# EAGLE board FAST_DEPLOY_E_FUSE (EAGLE 9.6.2)
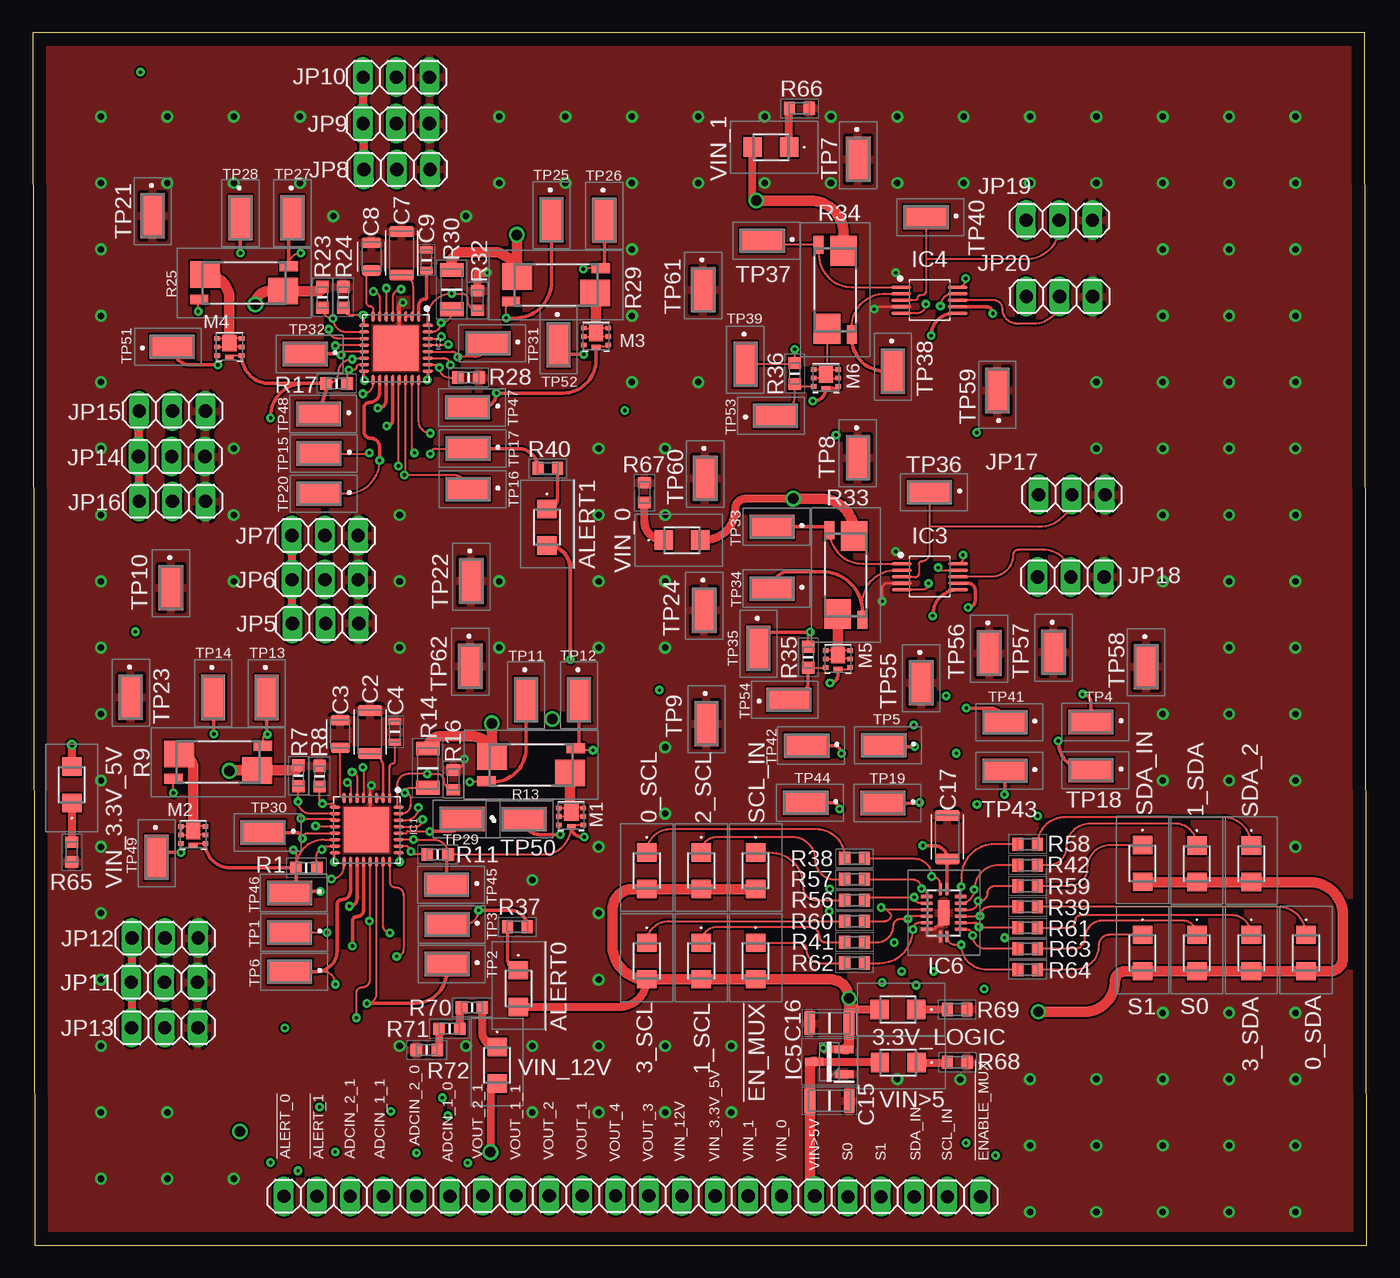
[diagram p6: board, top side]
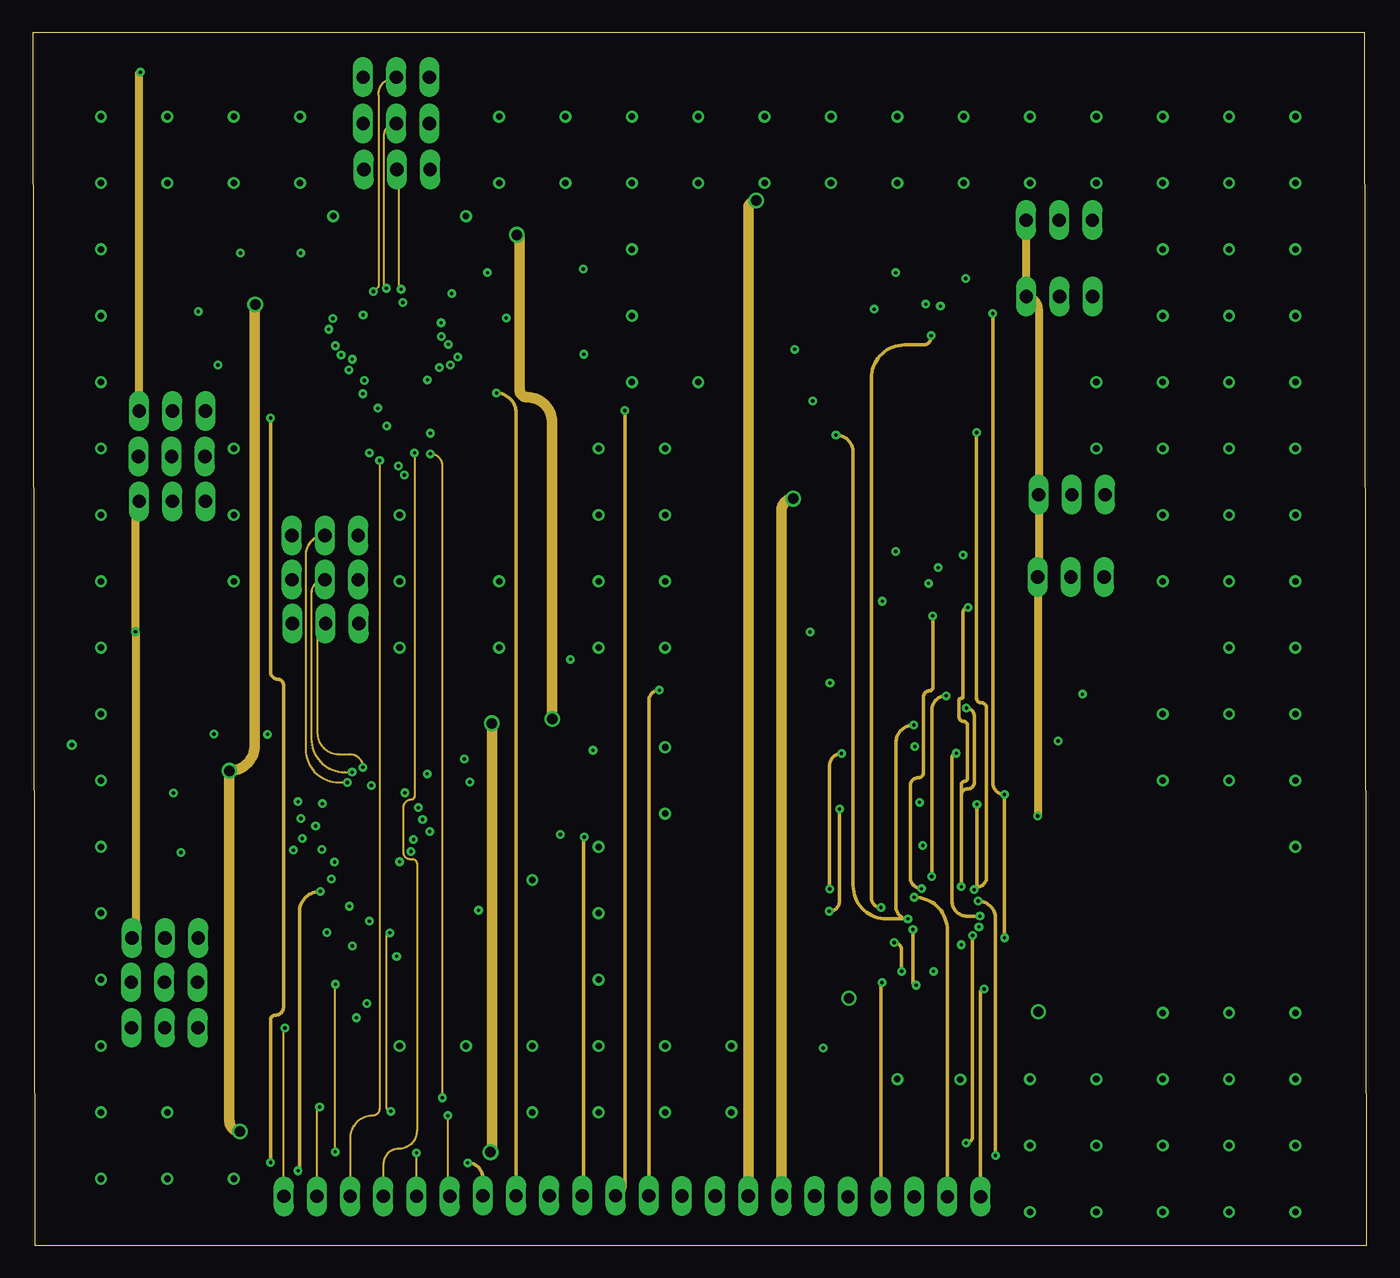
[diagram p7: board, inner layer Route2]
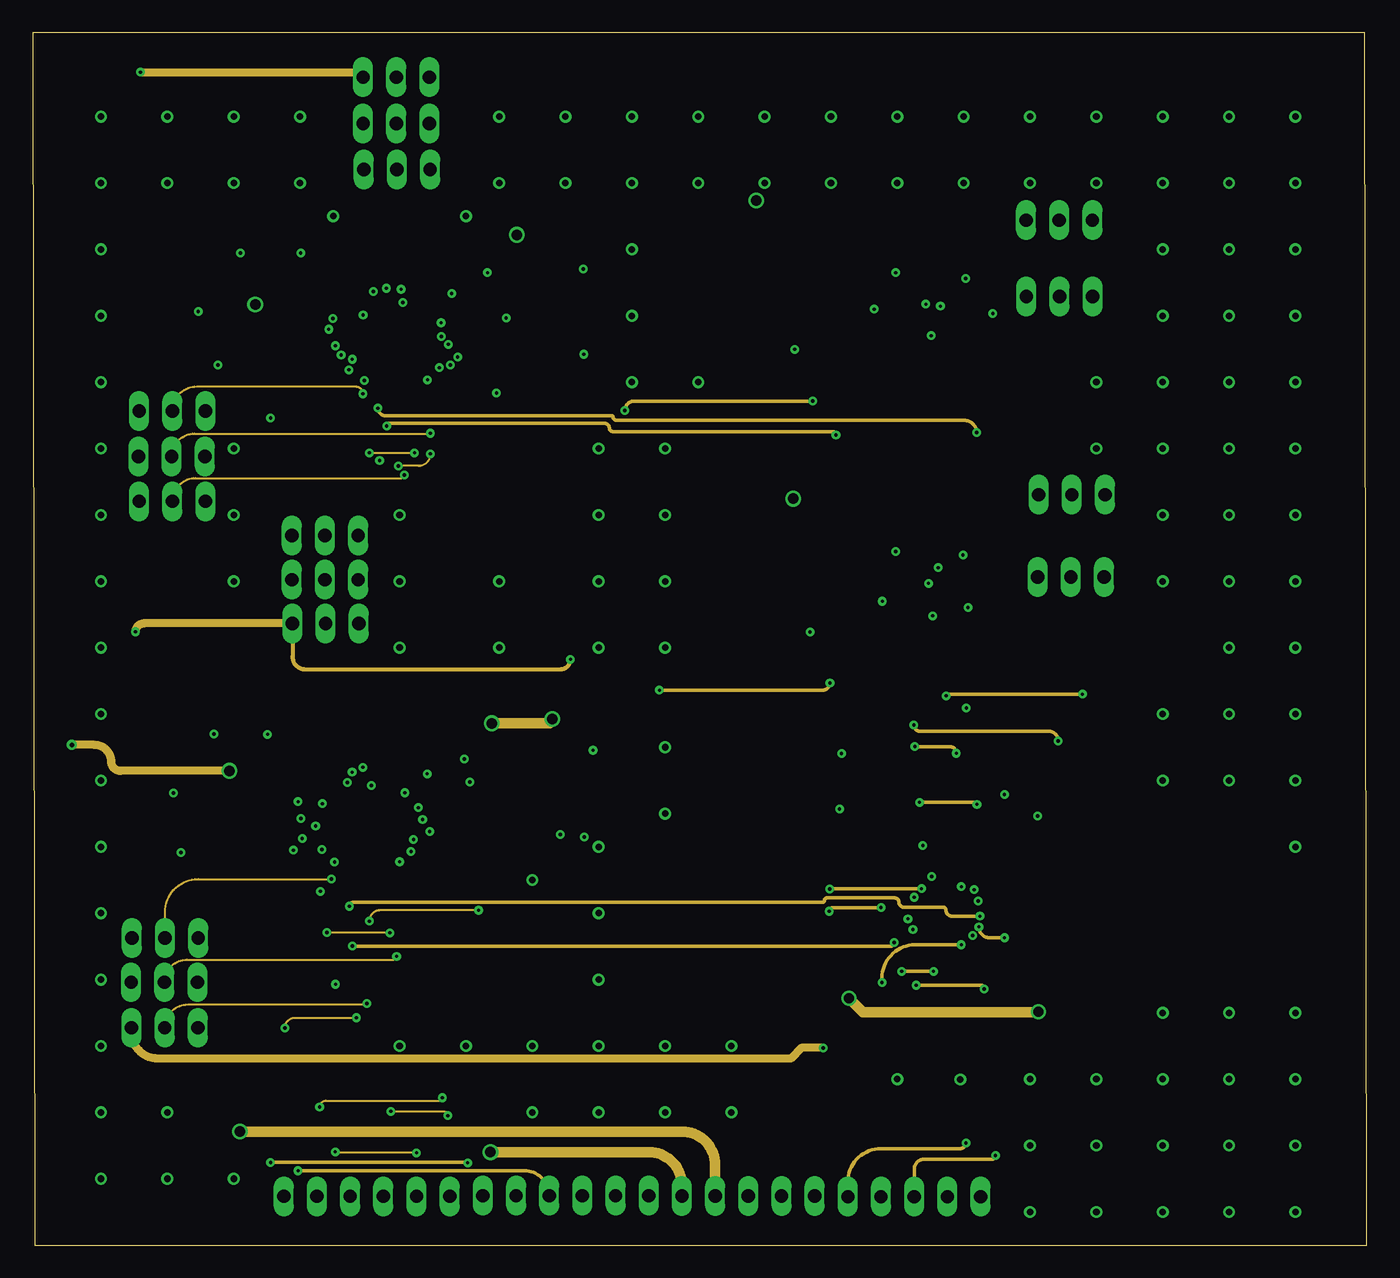
[diagram p8: board, inner layer Route15]
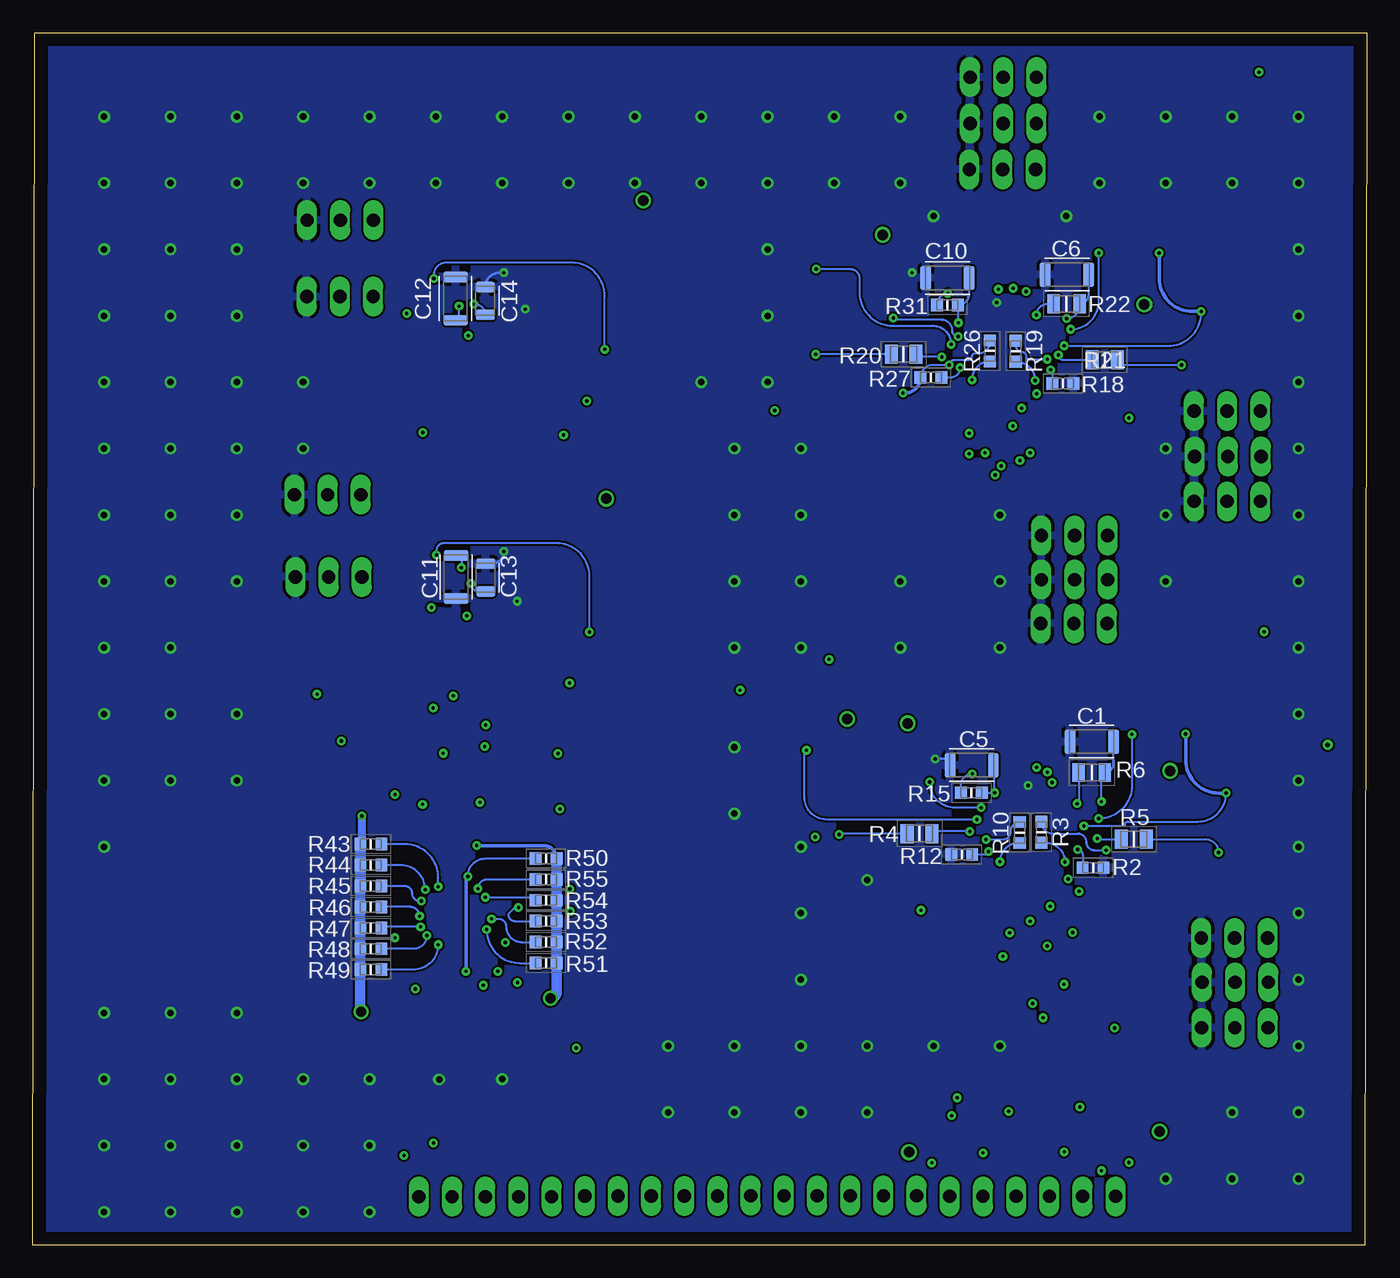
[diagram p9: board, bottom side, seen from below]

Size 102.14 x 92.79 mm. Coordinates in mm from the lower left corner, seen from the top.
Outline: 0.15,0 102.14,0 101.99,92.79 0,92.79 0.15,0
Copper layers (1+2*15+16): Top 0.035mm / dielectric 1.5mm / Route2 0.035mm / dielectric 0.15mm / Route15 0.035mm / dielectric 0.2mm / Bottom 0.035mm
Design rules "default *": minimum track width 6mil, minimum drill 0.2mm, track to track 6mil, track to pad 6mil, pad to pad 6mil, via to via 6mil, smd to smd 6mil, copper to edge 40mil, drill to drill 6mil, minimum pad ring 10mil, minimum via ring 8mil, stop-mask expansion 0mil, vias tented up to drill 40mil, thermal gap 10mil

## Footprints (pad centres in the part's own frame; a part is rotated, then mirrored left to right if it is on the bottom)
AA3021LSYSKJ3TR = smd 1.4 x 1.5: 1 -1.4,0; 2 1.4,0
CAPC3216X180N = smd 0.826 x 1.85: 1 -1.662,0; 2 1.662,0
CAPC2012X145N = smd 0.792 x 1.465: 1 -1.062,0; 2 1.062,0
CAPC1608X90N = smd 0.54 x 0.94: 1 -0.8,0; 2 0.8,0
CAPC3216X190N = smd 0.82 x 1.82: 1 -1.5,0; 2 1.5,0
QFN50P500X500X80-33T345N = smd 0.848 x 0.247: 1 -2.433,1.75; 2 -2.433,1.25; 3 -2.433,0.75; 4 -2.433,0.25; 5 -2.433,-0.25; 6 -2.433,-0.75; 7 -2.433,-1.25; 8 -2.433,-1.75; 17 2.433,-1.75; 18 2.433,-1.25; 19 2.433,-0.75; 20 2.433,-0.25; 21 2.433,0.25; 22 2.433,0.75; 23 2.433,1.25; 24 2.433,1.75 | smd 0.247 x 0.848: 9 -1.75,-2.433; 10 -1.25,-2.433; 11 -0.75,-2.433; 12 -0.25,-2.433; 13 0.25,-2.433; 14 0.75,-2.433; 15 1.25,-2.433; 16 1.75,-2.433; 25 1.75,2.433; 26 1.25,2.433; 27 0.75,2.433; 28 0.25,2.433; 29 -0.25,2.433; 30 -0.75,2.433; 31 -1.25,2.433; 32 -1.75,2.433 | smd 3.45 x 3.45: 33 0,0
SOP50P490X110-10N = smd 1.544 x 0.279: 1 -2.156,1; 2 -2.156,0.5; 3 -2.156,0; 4 -2.156,-0.5; 5 -2.156,-1; 6 2.156,-1; 7 2.156,-0.5; 8 2.156,0; 9 2.156,0.5; 10 2.156,1
SOT95P255X145-3N = smd 1.4 x 0.6: 1 -1.15,0.95; 2 -1.15,-0.95; 3 1.15,0
74HCT595BQ115 = smd 0.9 x 0.24: 1 -1.8,-0.25; 8 1.8,-0.25; 9 1.8,0.25; 16 -1.8,0.25 | smd 0.24 x 0.9: 2 -1.25,-1.3; 3 -0.75,-1.3; 4 -0.25,-1.3; 5 0.25,-1.3; 6 0.75,-1.3; 7 1.25,-1.3; 10 1.25,1.3; 11 0.75,1.3; 12 0.25,1.3; 13 -0.25,1.3; 14 -0.75,1.3; 15 -1.25,1.3 | smd 1.9 x 0.9: 17 0,0
1X06 = drill 1.016 long: 1 -6.35,0; 2 -3.81,0; 3 -1.27,0; 4 1.27,0; 5 3.81,0; 6 6.35,0
1X04 = drill 1.016 long: 1 -3.81,0; 2 -1.27,0; 3 1.27,0; 4 3.81,0
1X05 = drill 1.016 long: 1 -5.08,0; 2 -2.54,0; 3 0,0; 4 2.54,0; 5 5.08,0
1X03 = drill 1.016 long: 1 -2.54,0; 2 0,0; 3 2.54,0
1X02 = drill 1.016 long: 1 -1.27,0; 2 1.27,0
TRANS_NTLUS3A18PZTAG = smd 0.43 x 0.35: 1 -0.935,0.65; 2 -0.935,0; 3 -0.935,-0.65; 4 0.935,-0.65; 5 0.935,0; 6 0.935,0.65 | smd 1.1 x 1.25: 7 0,0.285 | smd 0.66 x 0.35: 8 0,-0.775
RESC1608X55N = smd 0.9 x 0.95: 1 -0.8,0; 2 0.8,0
RESC2012X60N = smd 1 x 1.45: 1 -0.95,0; 2 0.95,0
RESC2012X50N = smd 0.95 x 1.45: 1 -1,0; 2 1,0
WSK2512R0100FEA = smd 2.29 x 2.03: 1 -2.985,0.635; 3 2.985,-0.635 | smd 1.4 x 0.76: 2 -3.43,-1.27; 4 3.43,1.27
RESC3216X60N = smd 1.05 x 1.8: 1 -1.5,0; 2 1.5,0
RESC1608X50N = smd 0.85 x 1: 1 -0.75,0; 2 0.75,0
S175146R = smd 3.45 x 1.85: 1 0,0

## Placement (x,y rotation side)
0_SCL  AA3021LSYSK_J3-TR  [AA3021LSYSKJ3TR]  47.02,28.65 270 top
0_SDA  AA3021LSYSK_J3-TR  [AA3021LSYSKJ3TR]  97.49,22.35 270 top
1_SCL  AA3021LSYSK_J3-TR  [AA3021LSYSKJ3TR]  51.18,21.74 270 top
1_SDA  AA3021LSYSK_J3-TR  [AA3021LSYSKJ3TR]  89.13,29.18 270 top
2_SCL  AA3021LSYSK_J3-TR  [AA3021LSYSKJ3TR]  51.18,28.65 270 top
3.3V_LOGIC  AA3021LSYSK_J3-TR  [AA3021LSYSKJ3TR]  66.24,18.03 180 top
3_SCL  AA3021LSYSK_J3-TR  [AA3021LSYSKJ3TR]  47.02,21.74 270 top
3_SDA  AA3021LSYSK_J3-TR  [AA3021LSYSKJ3TR]  93.29,22.35 270 top
!ALERT0  AA3021LSYSK_J3-TR  [AA3021LSYSKJ3TR]  37.19,19.63 270 top
!ALERT1  AA3021LSYSK_J3-TR  [AA3021LSYSKJ3TR]  39.37,54.94 270 top
!EN_MUX  AA3021LSYSK_J3-TR  [AA3021LSYSKJ3TR]  55.35,21.74 270 top
C1  CGA5L2C0G1H104J160AA  [CAPC3216X180N]  21.06,38.53 180 bottom
C2  CGA5L2C0G1H104J160AA  [CAPC3216X180N]  25.83,39.27 90 top
C3  CGA4J3X7R1H105K125AB  [CAPC2012X145N]  23.55,39.12 90 top
C4  CGA3E2X7R1H683K080AA  [CAPC1608X90N]  27.74,39.29 90 top
C5  CGA5L2C0G1H104J160AA  [CAPC3216X180N]  30.25,36.73 180 bottom
C6  CGA5L2C0G1H104J160AA  [CAPC3216X180N]  22.96,74.27 180 bottom
C7  CGA5L2C0G1H104J160AA  [CAPC3216X180N]  28.24,75.92 90 top
C8  CGA4J3X7R1H105K125AB  [CAPC2012X145N]  25.93,75.64 90 top
C9  CGA3E2X7R1H683K080AA  [CAPC1608X90N]  30.15,75.39 90 top
C10  CGA5L2C0G1H104J160AA  [CAPC3216X180N]  32.11,74.02 180 bottom
C11  CGA5L2C0G1H104J160AA  [CAPC3216X180N]  69.72,51.13 270 bottom
C12  CGA5L2C0G1H104J160AA  [CAPC3216X180N]  69.77,72.44 90 bottom
C13  CGA4J3X7R1H105K125AB  [CAPC2012X145N]  67.46,51.08 90 bottom
C14  CGA4J3X7R1H105K125AB  [CAPC2012X145N]  67.49,72.26 90 bottom
C15  CGA5L3X7R1H225K160AB  [CAPC3216X190N]  61.01,11.05 0 top
C16  CGA5L3X7R1H225K160AB  [CAPC3216X190N]  60.99,16.99 180 top
C17  CGA5L2C0G1H104J160AA  [CAPC3216X180N]  70.03,31.22 270 top
IC1  LTC4222CUH#PBF  [QFN50P500X500X80-33T345N]  25.58,31.78 270 top
IC2  LTC4222CUH#PBF  [QFN50P500X500X80-33T345N]  27.81,68.63 270 top
IC3  ADM1177-2ARMZ-R7  [SOP50P490X110-10N]  68.68,51.16 0 top
IC4  ADM1177-2ARMZ-R7  [SOP50P490X110-10N]  68.66,72.31 0 top
IC5  MCP1792T-3302H_CB  [SOT95P255X145-3N]  60.99,14.02 180 top
IC6  74HC4852BQ,115  [74HCT595BQ115]  69.75,25.43 270 top
JP1  [1X06]  40.82,3.78 0 top
JP3  [1X04]  28.12,3.73 0 top
JP4  [1X05]  54.79,3.76 0 top
JP5  [1X03]  22.43,47.57 0 top
JP6  [1X03]  22.38,50.93 0 top
JP7  [1X03]  22.38,54.31 0 top
JP8  [1X03]  27.89,82.32 0 top
JP9  [1X03]  27.84,85.83 0 top
JP10  [1X03]  27.84,89.38 0 top
JP11  [1X03]  10.08,20.12 0 top
JP12  [1X03]  10.13,23.5 0 top
JP13  [1X03]  10.11,16.64 0 top
JP14  [1X03]  10.64,60.35 0 top
JP15  [1X03]  10.69,63.83 0 top
JP16  [1X03]  10.69,56.92 0 top
JP17  [1X03]  79.55,57.43 0 top
JP18  [1X03]  79.48,51.13 0 top
JP19  [1X03]  78.59,78.44 0 top
JP20  [1X03]  78.61,72.59 0 top
JP21  [1X02]  20.5,3.73 0 top
JP22  [1X05]  67.49,3.71 0 top
M1  NTLUS4C12NTAG  [TRANS_NTLUS3A18PZTAG]  41.22,32.82 0 top
M2  NTLUS4C12NTAG  [TRANS_NTLUS3A18PZTAG]  12.29,31.39 0 top
M3  NTLUS4C12NTAG  [TRANS_NTLUS3A18PZTAG]  43.13,69.52 0 top
M4  NTLUS4C12NTAG  [TRANS_NTLUS3A18PZTAG]  15.06,68.73 0 top
M5  NTLUS4C12NTAG  [TRANS_NTLUS3A18PZTAG]  61.65,44.86 0 top
M6  NTLUS4C12NTAG  [TRANS_NTLUS3A18PZTAG]  60.73,66.34 0 top
R1  CRCW06032K00FKEAC  [RESC1608X55N]  20.96,28.88 0 top
R2  CRCW06032K00FKEAC  [RESC1608X55N]  20.96,28.88 0 bottom
R3  CRCW060310K0JNEAC  [RESC1608X55N]  24.92,31.6 90 bottom
R4  CRCW080510R0JNEAHP  [RESC2012X60N]  34.24,31.5 0 bottom
R5  CRCW080510R0JNEAHP  [RESC2012X60N]  17.83,31.06 180 bottom
R6  CRCW08055K90FKTA  [RESC2012X50N]  21.06,36.17 180 bottom
R7  CRCW06032K00FKEAC  [RESC1608X55N]  20.35,35.92 270 top
R8  CRCW06032K00FKEAC  [RESC1608X55N]  21.97,35.89 90 top
R9  WSK2512R0250FEA  [WSK2512R0100FEA]  14.2,36.96 180 top
R10  CRCW060310K0JNEAC  [RESC1608X55N]  26.57,31.57 90 bottom
R11  CRCW060310K0JNEAC  [RESC1608X55N]  31.01,29.9 180 top
R12  CRCW06032K00FKEAC  [RESC1608X55N]  31.01,29.9 0 bottom
R13  WSK2512R0250FEA  [WSK2512R0100FEA]  38.15,36.75 0 top
R14  CRCW12067K00JNTA  [RESC3216X60N]  30.25,36.5 270 top
R15  CRCW06032K00FKEAC  [RESC1608X55N]  30.28,34.62 180 bottom
R16  CRCW0603820RFKEA  [RESC1608X50N]  32.21,35.61 90 top
R17  CRCW06032K00FKEAC  [RESC1608X55N]  23.27,65.94 0 top
R18  CRCW06032K00FKEAC  [RESC1608X55N]  23.27,65.94 0 bottom
R19  CRCW060310K0JNEAC  [RESC1608X55N]  26.87,68.4 90 bottom
R20  CRCW080510R0JNEAHP  [RESC2012X60N]  35.46,68.17 0 bottom
R21  CRCW080510R0JNEAHP  [RESC2012X60N]  20.07,67.74 180 bottom
R22  CRCW08055K90FKTA  [RESC2012X50N]  22.99,72.03 180 bottom
R23  CRCW06032K00FKEAC  [RESC1608X55N]  22.17,72.54 270 top
R24  CRCW06032K00FKEAC  [RESC1608X55N]  23.77,72.54 90 top
R25  WSK2512R0250FEA  [WSK2512R0100FEA]  16.18,73.63 180 top
R26  CRCW060310K0JNEAC  [RESC1608X55N]  28.85,68.43 90 bottom
R27  CRCW060310K0JNEAC  [RESC1608X55N]  33.38,66.4 0 bottom
R28  CRCW06032K00FKEAC  [RESC1608X55N]  33.38,66.4 180 top
R29  WSK2512R0250FEA  [WSK2512R0100FEA]  40.06,73.48 0 top
R30  CRCW12067K00JNTA  [RESC3216X60N]  32.08,73.13 270 top
R31  CRCW06032K00FKEAC  [RESC1608X55N]  32.11,71.93 180 bottom
R32  CRCW0603820RFKEA  [RESC1608X50N]  34.06,72.29 90 top
R33  WSK2512R0250FEA  [WSK2512R0100FEA]  62.26,51.28 270 top
R34  WSK2512R0250FEA  [WSK2512R0100FEA]  61.44,73.13 270 top
R35  CRCW06032K00FKEAC  [RESC1608X55N]  59.36,44.98 90 top
R36  CRCW06032K00FKEAC  [RESC1608X55N]  58.34,66.7 90 top
R37  CRCW0603820RFKEA  [RESC1608X50N]  37.11,24.36 0 top
R38  CRCW0603820RFKEA  [RESC1608X50N]  62.92,29.59 0 top
R39  CRCW0603820RFKEA  [RESC1608X50N]  76.17,25.88 180 top
R40  CRCW0603820RFKEA  [RESC1608X50N]  39.45,59.44 180 top
R41  CRCW0603820RFKEA  [RESC1608X50N]  62.92,23.19 0 top
R42  CRCW0603820RFKEA  [RESC1608X50N]  76.17,29.08 180 top
R43  CRCW06032K00FKEAC  [RESC1608X55N]  76.25,30.68 180 bottom
R44  CRCW06032K00FKEAC  [RESC1608X55N]  76.25,29.08 180 bottom
R45  CRCW06032K00FKEAC  [RESC1608X55N]  76.25,27.48 180 bottom
R46  CRCW06032K00FKEAC  [RESC1608X55N]  76.25,25.88 180 bottom
R47  CRCW06032K00FKEAC  [RESC1608X55N]  76.25,24.28 180 bottom
R48  CRCW06032K00FKEAC  [RESC1608X55N]  76.25,22.68 180 bottom
R49  CRCW06032K00FKEAC  [RESC1608X55N]  76.25,21.08 180 bottom
R50  CRCW06032K00FKEAC  [RESC1608X55N]  62.84,29.59 180 bottom
R51  CRCW06032K00FKEAC  [RESC1608X55N]  62.84,21.59 0 bottom
R52  CRCW06032K00FKEAC  [RESC1608X55N]  62.84,23.19 0 bottom
R53  CRCW06032K00FKEAC  [RESC1608X55N]  62.84,24.79 0 bottom
R54  CRCW06032K00FKEAC  [RESC1608X55N]  62.84,26.39 0 bottom
R55  CRCW06032K00FKEAC  [RESC1608X55N]  62.84,27.99 0 bottom
R56  CRCW0603820RFKEA  [RESC1608X50N]  62.92,26.39 0 top
R57  CRCW0603820RFKEA  [RESC1608X50N]  62.92,27.99 0 top
R58  CRCW0603820RFKEA  [RESC1608X50N]  76.17,30.68 180 top
R59  CRCW0603820RFKEA  [RESC1608X50N]  76.17,27.48 180 top
R60  CRCW0603820RFKEA  [RESC1608X50N]  62.92,24.79 0 top
R61  CRCW0603820RFKEA  [RESC1608X50N]  76.17,24.28 180 top
R62  CRCW0603820RFKEA  [RESC1608X50N]  62.92,21.59 0 top
R63  CRCW0603820RFKEA  [RESC1608X50N]  76.17,22.68 180 top
R64  CRCW0603820RFKEA  [RESC1608X50N]  76.17,21.08 180 top
R65  CRCW0603820RFKEA  [RESC1608X50N]  3,30.07 270 top
R66  CRCW0603820RFKEA  [RESC1608X50N]  58.7,87 0 top
R67  CRCW0603820RFKEA  [RESC1608X50N]  46.84,57.58 90 top
R68  CRCW0603820RFKEA  [RESC1608X50N]  70.79,14 0 top
R69  CRCW0603820RFKEA  [RESC1608X50N]  70.76,18.03 0 top
R70  CRCW06032K00FKEAC  [RESC1608X55N]  33.63,18.19 0 top
R71  CRCW06032K00FKEAC  [RESC1608X55N]  31.9,16.56 0 top
R72  CRCW06032K00FKEAC  [RESC1608X55N]  30.18,14.94 0 top
S0  AA3021LSYSK_J3-TR  [AA3021LSYSKJ3TR]  89.13,22.35 270 top
S1  AA3021LSYSK_J3-TR  [AA3021LSYSKJ3TR]  84.96,22.35 270 top
SCL_IN  AA3021LSYSK_J3-TR  [AA3021LSYSKJ3TR]  55.35,28.65 270 top
SDA_2  AA3021LSYSK_J3-TR  [AA3021LSYSKJ3TR]  93.29,29.18 270 top
SDA_IN  AA3021LSYSK_J3-TR  [AA3021LSYSKJ3TR]  84.96,29.21 270 top
TP1  S1751-46R  [S175146R]  19.68,23.93 0 top
TP2  S1751-46R  [S175146R]  31.72,21.51 0 top
TP3  S1751-46R  [S175146R]  31.72,24.54 0 top
TP4  S1751-46R  [S175146R]  81.03,40.03 0 top
TP5  S1751-46R  [S175146R]  65.15,38.25 0 top
TP6  S1751-46R  [S175146R]  19.68,20.93 0 top
TP7  S1751-46R  [S175146R]  63.2,83.08 90 top
TP8  S1751-46R  [S175146R]  63.17,60.25 90 top
TP9  S1751-46R  [S175146R]  51.59,39.9 90 top
TP10  S1751-46R  [S175146R]  10.59,50.32 90 top
TP11  S1751-46R  [S175146R]  37.77,41.73 90 top
TP12  S1751-46R  [S175146R]  41.83,41.73 90 top
TP13  S1751-46R  [S175146R]  17.91,41.91 90 top
TP14  S1751-46R  [S175146R]  13.82,41.91 90 top
TP15  S1751-46R  [S175146R]  21.95,60.58 0 top
TP16  S1751-46R  [S175146R]  33.32,57.84 0 top
TP17  S1751-46R  [S175146R]  33.32,60.96 0 top
TP18  S1751-46R  [S175146R]  81.03,36.35 0 top
TP19  S1751-46R  [S175146R]  65.1,33.83 0 top
TP20  S1751-46R  [S175146R]  21.95,57.51 0 top
TP21  S1751-46R  [S175146R]  9.19,78.79 90 top
TP22  S1751-46R  [S175146R]  33.58,50.83 90 top
TP23  S1751-46R  [S175146R]  7.52,41.94 90 top
TP24  S1751-46R  [S175146R]  51.41,48.59 90 top
TP25  S1751-46R  [S175146R]  39.73,78.46 90 top
TP26  S1751-46R  [S175146R]  43.76,78.44 90 top
TP27  S1751-46R  [S175146R]  19.89,78.61 90 top
TP28  S1751-46R  [S175146R]  15.9,78.61 90 top
TP29  S1751-46R  [S175146R]  32.87,32.61 0 top
TP30  S1751-46R  [S175146R]  17.65,31.57 0 top
TP31  S1751-46R  [S175146R]  34.85,69.01 0 top
TP32  S1751-46R  [S175146R]  20.85,68.2 0 top
TP33  S1751-46R  [S175146R]  56.59,54.97 0 top
TP34  S1751-46R  [S175146R]  56.59,50.24 0 top
TP35  S1751-46R  [S175146R]  55.58,45.67 90 top
TP36  S1751-46R  [S175146R]  68.66,57.61 0 top
TP37  S1751-46R  [S175146R]  55.85,76.86 0 top
TP38  S1751-46R  [S175146R]  65.86,66.88 90 top
TP39  S1751-46R  [S175146R]  54.56,67.41 90 top
TP40  S1751-46R  [S175146R]  68.4,78.66 0 top
TP41  S1751-46R  [S175146R]  74.42,40.01 0 top
TP42  S1751-46R  [S175146R]  59.26,38.23 0 top
TP43  S1751-46R  [S175146R]  74.42,36.3 0 top
TP44  S1751-46R  [S175146R]  59.18,33.86 0 top
TP45  S1751-46R  [S175146R]  31.7,27.58 0 top
TP46  S1751-46R  [S175146R]  19.66,26.95 0 top
TP47  S1751-46R  [S175146R]  33.3,64.11 0 top
TP48  S1751-46R  [S175146R]  21.89,63.6 0 top
TP49  S1751-46R  [S175146R]  9.5,29.67 90 top
TP50  S1751-46R  [S175146R]  37.62,32.59 180 top
TP51  S1751-46R  [S175146R]  10.69,68.76 180 top
TP52  S1751-46R  [S175146R]  40.26,68.91 90 top
TP53  S1751-46R  [S175146R]  56.87,63.47 180 top
TP54  S1751-46R  [S175146R]  57.91,41.73 180 top
TP55  S1751-46R  [S175146R]  68.02,43.05 90 top
TP56  S1751-46R  [S175146R]  73.23,45.31 90 top
TP57  S1751-46R  [S175146R]  78.16,45.36 90 top
TP58  S1751-46R  [S175146R]  85.24,44.27 90 top
TP59  S1751-46R  [S175146R]  73.86,65.41 270 top
TP60  S1751-46R  [S175146R]  51.49,58.67 90 top
TP61  S1751-46R  [S175146R]  51.33,73.1 90 top
TP62  S1751-46R  [S175146R]  33.5,44.3 90 top
VIN>5  AA3021LSYSK_J3-TR  [AA3021LSYSKJ3TR]  66.27,13.97 180 top
VIN_0  AA3021LSYSK_J3-TR  [AA3021LSYSKJ3TR]  49.71,53.95 0 top
VIN_1  AA3021LSYSK_J3-TR  [AA3021LSYSKJ3TR]  56.52,84.02 180 top
VIN_3.3V_5V  AA3021LSYSK_J3-TR  [AA3021LSYSKJ3TR]  3,35.23 90 top
VIN_12V  AA3021LSYSK_J3-TR  [AA3021LSYSKJ3TR]  35.56,13.77 270 top

## Tracks (layer width: path | path; a pad name or v marks a point on that pad's centre or on a via)
0_SCL
  Top 0.152: 0_SCL.1 arc-90 48.82,31.85 59.97,31.85 arc-90 62.17,29.66 R38.1
0_SDA
  Top 0.152: 0_SDA.1 arc90 95.35,25.88 R39.1
1_SCL
  Top 0.152: 1_SCL.1 arc-90 52.4,24.36 59.46,24.36 arc-90 60.22,23.6 arc90 60.63,23.19 R41.1
1_SDA
  Top 0.152: 1_SDA.1 arc90 87.46,32.26 80.98,32.26 arc90 79.12,30.4 arc-90 77.8,29.08 R42.1
2_SDA
  Top 0.152: SDA_2.1 arc90 91.14,32.74 78.98,32.74 arc90 R58.1
3.3V_LOGIC  (via drill 0.25, 0.75)
  Top 0.254: IC6.16 70,29.52 arc-90 C17.2 arc90 69,30.58 v68.15,30.58
  Top 0.305: v41.17,44.83 41.17,51.74 arc90 !ALERT1.2
  Top 0.61: 19.84,47.62 arc90 JP5.1 arc-90 19.84,47.62 | JP13.1 arc90 7.59,16.66 JP12.1 7.59,20.17 arc-90 JP11.1 | IC5.2 60.65,14.97 arc-90 v60.53,15.09 | !ALERT0.2 44.91,18.23 arc90 3_SCL.2 1_SCL.2 | S0.2 93.12,20.95 0_SDA.2 | 1_SDA.2 84.99,27.79 | !EN_MUX.2 51.21,20.34 | JP16.1 JP15.1 arc90 8.1,63.78 JP14.1 | 2_SCL.2 46.76,27.25 | 0_SCL.2 51.21,27.25 | 3_SDA.2 97.82,20.95 | JP7.1 JP6.1 19.84,47.62 | v62.49,18.89 arc90 63.35,18.03 3.3V_LOGIC.2 | JP10.1 25.3,82.37 arc90 JP8.1 25.35,85.78 arc90 JP9.1 JP10.1
  Top 0.813: IC5.2 arc90 62.49,15.32 C16.1 v62.49,18.89 arc90 61.04,20.34 51.21,20.34 3_SCL.2 46.94,20.34 arc-90 44.4,22.88 44.4,25.7 arc-90 45.95,27.25 46.76,27.25 51.21,27.25 SCL_IN.2 | SDA_IN.2 arc90 84.99,27.79 SDA_2.2 97.76,27.79 arc-90 100.3,25.25 100.3,21.95 arc-90 99.31,20.95 97.82,20.95 93.12,20.95 S1.2 83.61,20.95 arc90 82.85,20.19 arc-90 80.52,17.86 v76.99,17.86
  Route2 0.61: JP19.1 76.05,72.62 arc90 JP20.1 arc-90 77.01,71.65 JP17.1 77.01,51.21 arc-90 JP18.1 v76.94,32.84 | JP12.1 arc90 7.87,23.77 v7.87,46.94 7.87,56.64 arc-90 JP16.1 | JP15.1 8.15,89.66 arc-90 v8.26,89.76
  Route15 0.305: JP5.1 19.89,45.03 arc90 20.85,44.07 40.41,44.07 arc90 v41.17,44.83
  Route15 0.61: v60.53,15.09 58.85,15.09 58.04,14.28 9.6,14.28 arc-90 7.57,16.31 JP13.1 | JP5.1 8.51,47.57 arc90 v7.87,46.94 | v8.26,89.76 24.92,89.76 arc-90 JP10.1
  Route15 0.813: v76.99,17.86 76.96,17.83 63.55,17.83 v62.49,18.89
  Bottom 0.254: v68.15,30.58 63.03,30.58 arc90 R50.1
  Bottom 0.61: v76.94,32.84 76.94,28.96 | 76.94,28.96 76.94,27.75 arc90 77.05,27.64 R44.2 | R55.2 R54.2 62.04,25.4 | R53.2 62.04,22.86 | R52.2 R51.2 | R43.2 R44.2 arc-90 76.94,28.96 | R45.2 77.05,25.91 | R46.2 77.05,24.38 | R47.2 77.05,22.73 | R48.2 R49.2
  Bottom 0.813: R50.1 62.04,25.4 62.04,22.86 R51.2 62.04,19.34 arc90 v62.49,18.89 | R43.2 77.05,27.64 77.05,25.91 77.05,24.38 77.05,22.73 R49.2 77.05,17.92 arc-90 v76.99,17.86
3_SCL
  Top 0.152: 3_SCL.1 arc-90 48.66,24.79 R60.1
3_SDA
  Top 0.152: 3_SDA.1 arc90 91.8,25.25 80.21,25.25 arc90 79.83,24.87 arc-90 79.25,24.28 R61.1
!ALERT0
  Top 0.254: R37.1 36.36,21.86 arc90 !ALERT0.1
!ALERT1
  Top 0.254: R40.1 40.2,57.17 arc-90 !ALERT1.1
!ALERT_0  (via drill 0.25)
  Top 0.152: v24.79,17.4 24.79,19.3 arc-90 25.22,19.74 arc90 25.83,20.34 25.83,24.85 | 25.83,24.85 IC1.21 | TP3.1 33.05,24.54 arc90 v34.14,25.63 | v25.77,24.79 arc90 25.83,24.85
  Top 0.254: v34.14,25.63 36.59,25.63 arc-90 R37.2
  Route2 0.152: JP21.1 19.23,16.54 arc-90 v19.3,16.61
  Route15 0.152: v19.3,16.61 arc-90 20.09,17.4 v24.79,17.4 | v34.14,25.63 26.61,25.63 arc90 v25.77,24.79
!ALERT_1  (via drill 0.25)
  Top 0.152: v30.45,60.55 arc-90 30.86,60.96 TP17.1 | v28,59.63 28,66.14 arc-90 IC2.21
  Top 0.254: R40.2 arc90 37.17,60.96 TP17.1
  Route2 0.152: JP21.2 21.77,10.36 arc-90 v21.97,10.57 | v31.37,11.28 31.37,59.64 arc90 v30.45,60.55
  Route15 0.152: v21.97,10.57 arc-90 22.45,11.05 31.14,11.05 arc90 v31.37,11.28 | v30.45,60.55 arc-90 29.53,59.63 v28,59.63
!EN_1_0  (via drill 0.25)
  Top 0.152: IC1.24 27.33,27.84 arc90 27.79,27.38 arc-90 28.4,26.77 28.4,22.63 arc-90 v27.86,22.1
  Route15 0.152: JP11.2 arc-90 11.81,21.84 27.61,21.84 arc90 v27.86,22.1
!EN_1_1  (via drill 0.25)
  Top 0.152: v30.45,62.13 arc-90 29.56,63.02 IC2.24
  Route15 0.152: JP14.2 arc-90 12.4,62.1 30.43,62.1 arc90 v30.45,62.13
!EN_2_0  (via drill 0.25)
  Top 0.152: v22.86,28.02 arc90 23.83,28.98 IC1.17
  Route15 0.152: JP12.2 10.13,25.48 arc-90 12.67,28.02 v22.86,28.02
!EN_2_1  (via drill 0.25)
  Top 0.152: v25.27,65.15 arc90 26.06,65.94 IC2.17
  Route15 0.152: JP15.2 arc-90 12.57,65.71 24.71,65.71 arc-90 v25.27,65.15
!EN_MUX
  Top 0.152: !EN_MUX.1 58.72,23.14 arc-90 59.23,22.63 arc90 60.27,21.59 R62.1
!ENABLE_MUX  (via drill 0.25)
  Top 0.152: IC6.6 67.91,24.68 arc90 v67.39,24.16 67.39,24.13 arc-90 64.85,21.59 R62.2
  Route2 0.254: JP22.5 72.57,19.33 arc-90 v72.85,19.61 | v67.64,19.89 arc-90 67.39,20.14 v67.39,24.16
  Route15 0.254: v72.85,19.61 arc90 72.57,19.89 v67.64,19.89
  Bottom 0.152: v67.39,24.16 67.39,24.13 arc-90 64.85,21.59 R51.1
ADCIN_1_0  (via drill 0.25)
  Top 0.152: TP1.1 v22.53,23.93 | v27.36,23.9 arc-90 26.83,24.43 IC1.23
  Route2 0.152: v27.36,23.9 arc90 27.08,23.62 27.08,10.59 arc90 v27.43,10.24 | v31.78,9.91 31.78,3.89 arc90 JP3.4
  Route15 0.152: v22.53,23.93 27.33,23.93 arc-90 v27.36,23.9 | v27.43,10.24 31.45,10.24 arc-90 v31.78,9.91
ADCIN_1_1  (via drill 0.25)
  Top 0.152: TP15.1 25.73,60.58 arc90 v25.78,60.63 | v29.24,60.63 arc-90 29.06,60.8 IC2.23
  Route2 0.152: v29.24,60.63 29.24,34.34 arc-90 28.98,34.09 arc90 28.37,33.48 28.37,30.07 arc90 28.91,29.54 29.08,29.54 arc-90 29.41,29.21 29.41,8.76 arc-90 28.02,7.37 arc90 26.85,6.2 JP3.2
  Route15 0.152: v25.78,60.63 v29.24,60.63
ADCIN_2_0  (via drill 0.25)
  Top 0.152: TP6.1 22.23,20.93 arc-90 v23.19,19.96
  Top 0.254: TP6.1 21.69,20.93 arc90 23.32,22.55 23.32,26.11 arc-90 23.65,26.44 arc90 24.33,27.12 IC1.18
  Route2 0.152: JP3.3 v29.39,7.06 | v23.16,7.14 23.16,19.94 arc-90 v23.19,19.96
  Route15 0.152: v29.39,7.06 23.24,7.06 arc-90 v23.16,7.14
ADCIN_2_1  (via drill 0.25)
  Top 0.152: v26.56,60.05 arc-90 24.02,57.51 TP20.1
  Top 0.254: v26.56,60.05 26.56,61.07 arc90 25.88,61.75 arc-90 25.37,62.26 25.37,64.08 arc-90 25.78,64.49 arc90 26.56,65.27 IC2.18
  Route2 0.152: v26.56,60.05 26.56,10.46 arc-90 26.01,9.91 arc90 24.31,8.2 JP3.1
ADR0_0  (via drill 0.25)
  Top 0.152: v25.29,36.57 arc-90 25.33,36.53 IC1.5
  Route2 0.152: JP5.2 arc90 21.79,46.94 21.79,39.22 arc90 23.44,37.57 24.29,37.57 arc-90 v25.29,36.57
ADR0_1  (via drill 0.25)
  Top 0.152: v28.21,73.15 arc90 27.56,72.51 IC2.5
  Route2 0.152: JP8.2 28.03,82.18 28.03,73.33 v28.21,73.15
ADR1_0  (via drill 0.25)
  Top 0.152: v24.46,36.19 arc-90 24.83,35.83 IC1.6
  Route2 0.152: JP6.2 arc90 21.34,49.89 21.34,38.73 arc90 23.88,36.19 v24.46,36.19
ADR1_1  (via drill 0.25)
  Top 0.152: v27.08,73.23 arc90 27.06,73.21 IC2.6
  Route2 0.152: v27.08,73.23 arc-90 26.9,73.41 26.9,84.89 arc-90 JP9.2
ADR2_0  (via drill 0.25)
  Top 0.152: v24.1,35.41 arc-90 24.33,35.18 IC1.7
  Route2 0.152: JP7.2 arc90 20.9,52.83 20.9,37.95 arc90 23.44,35.41 v24.1,35.41
ADR2_1  (via drill 0.25)
  Top 0.152: v26.09,72.97 arc-90 26.56,72.5 IC2.7
  Route2 0.152: v26.09,72.97 26.47,73.36 26.47,88.01 arc-90 JP10.2
ADR_0
  Top 0.152: JP18.2 arc90 77.39,53.21 75.46,53.21 arc90 75.06,52.81 arc-90 73.41,51.16 IC3.8
ADR_1
  Top 0.152: JP20.2 78.61,72.44 arc-90 76.68,70.51 75.39,70.51 arc-90 74.24,71.65 arc90 73.58,72.31 IC4.8
FB1_JUNCTION  (via drill 0.25)
  Top 0.152: R12.2 29.24,29.9 arc-90 28.85,30.28 | 28.85,30.28 arc90 28.61,30.52 IC1.26 | v28.97,30.13 arc-90 28.85,30.24 28.85,30.28
  Bottom 0.152: R12.2 29.2,29.9 arc-90 v28.97,30.13
FB1_JUNCTION_1  (via drill 0.25)
  Top 0.152: IC2.26 30.9,67.38 arc-90 v31.13,67.15 arc90 31.89,66.4 R28.2
  Bottom 0.152: v31.13,67.15 arc90 31.89,66.4 R28.2
FB2_JUNCTION  (via drill 0.25)
  Top 0.152: R2.1 21.76,29.88 arc-90 v22.15,30.28 arc-90 22.4,30.52 IC1.15
  Bottom 0.152: v22.15,30.28 arc90 21.76,29.88 R2.1
FB2_JUNCTION_1  (via drill 0.25)
  Top 0.152: IC2.15 24.99,67.38 arc90 24.79,67.18 arc-90 24.59,66.98 v24.21,66.98 arc90 24.07,66.84 R18.1
  Bottom 0.152: v24.21,66.98 arc90 24.07,66.84 R18.1
GATE1  (via drill 0.25)
  Top 0.152: IC1.28 28.55,31.52 arc90 28.65,31.62 arc-90 28.7,31.67 30.38,31.67 arc-90 v30.39,31.66
  Top 0.254: TP29.1 arc-90 31.91,31.66 v30.39,31.66
  Bottom 0.152: v30.39,31.66 33.12,31.66 arc-90 R4.2
GATE1_1  (via drill 0.25)
  Top 0.152: IC2.28 32.13,68.38 arc-90 v32.54,67.97 33.81,67.97 arc90 TP31.1
  Bottom 0.152: v32.54,67.97 34.31,67.97 arc90 R20.2
GATE2  (via drill 0.25)
  Top 0.152: v20.64,31.11 arc-90 21.05,31.52 IC1.13
  Top 0.254: TP30.1 20.17,31.57 arc-90 v20.64,31.11
  Bottom 0.152: v20.64,31.11 20.59,31.06 R5.2
GATE2_1  (via drill 0.25)
  Top 0.152: IC2.13 23.88,68.38 arc90 v23.61,68.11
  Top 0.254: TP32.1 23.53,68.2 arc-90 v23.61,68.11
  Bottom 0.152: v23.61,68.11 arc-90 23.24,67.74 R21.2
GATE_1_INPUT  (via drill 0.25)
  Top 0.152: v40.39,31.42 arc-90 40.29,31.52 M1.3
  Top 0.254: TP50.1 arc90 38.79,31.42 v40.39,31.42
  Bottom 0.152: R4.1 40.31,31.5 arc-90 v40.39,31.42
GATE_1_INPUT_1  (via drill 0.25)
  Top 0.152: v42.19,68.17 M3.3 arc-90 M3.3
  Top 0.254: v42.19,68.17 40.39,68.17 arc-90 TP52.1
  Bottom 0.152: R20.1 v42.19,68.17
GATE_2  (via drill 0.25)
  Top 0.152: R35.2 59.36,46.76 arc-90 v59.51,46.91 | v71.22,52.81 71.22,52.54 arc-90 IC3.10
  Top 0.254: TP35.1 arc-90 56.82,46.91 v59.51,46.91
  Bottom 0.152: v59.51,46.91 59.51,51.18 arc-90 62.05,53.72 70.66,53.72 arc-90 71.22,53.16 v71.22,52.81
GATE_2_INPUT  (via drill 0.25)
  Top 0.152: v11.35,30.05 M2.3 arc-90 M2.3
  Top 0.254: TP49.1 arc-90 9.88,30.05 v11.35,30.05
  Bottom 0.152: R5.1 12.37,31.06 arc90 v11.35,30.05
GATE_2_INPUT_1  (via drill 0.25)
  Top 0.152: v14.17,67.36 arc-90 14.13,67.41 M4.3
  Top 0.254: TP51.1 arc90 12.09,67.36 v14.17,67.36
  Bottom 0.152: R21.1 arc-90 18.74,67.36 v14.17,67.36
GATE_3  (via drill 0.25)
  Top 0.152: v58.34,68.56 R36.2 arc-90 58.26,67.41 TP39.1 | v71.42,73.97 71.42,73.93 arc-90 IC4.10
  Bottom 0.152: v58.34,68.56 58.34,72.64 arc-90 60.88,75.18 70.49,75.18 arc-90 71.42,74.24 v71.42,73.97
GATE_CONNECT_0
  Top 0.152: R35.1 60.69,44.18 arc90 M5.3
  Top 0.254: TP54.1 arc90 59.36,43.18 R35.1
GATE_CONNECT_1
  Top 0.152: M6.3 58.55,65.69 arc-90 R36.1 58.34,64.95 arc-90 TP53.1
GND  (via drill 0.25, 0.5)
  Top 0.203: IC6.17 69.75,24.64 arc-90 69.49,24.38 69.24,24.38 arc90 69.11,24.26 arc-90 69.03,24.18 IC6.7 68.45,23.62 IC6.8 | IC1.4 25.83,35.07 arc-90 v25.93,35.18 | IC4.4 64.6,71.81 arc90 v64.41,71.63 | IC3.4 65.41,50.66 arc90 65.05,50.29 v65.05,49.28 | v33.05,37.21 33.05,37.2 arc-90 R16.2
  Top 0.254: IC2.4 28.06,68.88 arc-90 IC2.33 | IC1.4 25.83,32.02 arc-90 IC1.33
  Top 0.305: IC2.4 28.06,71.85 arc-90 v28.35,72.14
  Top 0.61: R32.2 34.06,74.42 v34.82,74.42
  Bottom 0.203: C14.2 arc90 66.39,74.42 v66.07,74.42 | C13.2 67.01,52.14 arc-90 v66.07,53.09 | C5.2 arc-90 32.4,37.21 v33.05,37.21
  other vias: 5.23,86.36 10.31,86.36 15.39,86.36 20.47,86.36 20.47,81.28 15.39,81.28 10.31,81.28 5.23,81.28 23.01,78.74 5.23,76.2 5.23,71.12 5.23,66.04 5.23,60.96 5.23,55.88 5.23,50.8 5.23,45.72 5.23,40.64 5.23,35.56 5.23,30.48 5.23,25.4 5.23,20.32 5.23,15.24 5.23,10.16 10.31,10.16 10.31,5.08 5.23,5.08 15.39,5.08 28.09,15.24 33.17,15.24 38.25,15.24 38.25,10.16 43.33,15.24 43.33,10.16 48.41,10.16 48.41,15.24 53.49,15.24 53.49,10.16 76.35,12.7 76.35,7.62 76.35,2.54 81.43,12.7 81.43,7.62 81.43,2.54 86.51,12.7 86.51,7.62 86.51,2.54 91.59,2.54 91.59,7.62 91.59,12.7 91.59,17.78 86.51,17.78 96.67,17.78 96.67,12.7 96.67,7.62 96.67,2.54 96.67,30.48 96.67,35.56 91.59,35.56 86.51,35.56 86.51,40.64 91.59,40.64 96.67,40.64 96.67,45.72 91.59,45.72 91.59,50.8 96.67,50.8 86.51,50.8 96.67,55.88 91.59,55.88 86.51,55.88 96.67,60.96 91.59,60.96 86.51,60.96 81.43,60.96 96.67,66.04 91.59,66.04 86.51,66.04 81.43,66.04 86.51,71.12 91.59,71.12 96.67,71.12 96.67,76.2 91.59,76.2 86.51,76.2 96.67,81.28 96.67,86.36 91.59,86.36 91.59,81.28 86.51,86.36 86.51,81.28 81.43,86.36 81.43,81.28 76.35,86.36 76.35,81.28 71.27,86.36 71.27,81.28 56.03,81.28 61.11,81.28 66.19,81.28 66.19,86.36 61.11,86.36 56.03,86.36 50.95,86.36 50.95,81.28 45.87,81.28 45.87,86.36 40.79,86.36 40.79,81.28 35.71,86.36 35.71,81.28 33.17,78.74 45.87,76.2 45.87,71.12 45.87,66.04 50.95,66.04 48.41,60.96 48.41,55.88 48.41,50.8 48.41,45.72 43.33,60.96 43.33,55.88 43.33,50.8 43.33,45.72 48.41,38.1 48.41,33.02 43.33,30.48 43.33,25.4 38.25,27.94 43.33,20.32 35.71,45.72 35.71,50.8 28.09,50.8 28.09,45.72 28.09,55.88 15.39,55.88 15.39,50.8 15.39,60.96 71.02,12.67 66.19,12.7
  pour Bottom: 0.15,93.45 102.49,93.45 102.49,-0.23 0.15,-0.23
  pour Top: -0.84,93.9 102.95,93.9 102.95,-0.71 -0.84,-0.71
GPIO1_0  (via drill 0.25)
  Top 0.152: v28.09,29.34 28.09,29.94 arc90 IC1.25
  Bottom 0.152: R10.1 26.66,30.77 arc-90 v28.09,29.34
GPIO1_1  (via drill 0.25)
  Top 0.152: v30.23,66.22 30.23,66.86 arc-90 IC2.25
  Bottom 0.152: R26.1 arc-90 30.23,66.26 v30.23,66.22
GPIO2_0  (via drill 0.25)
  Top 0.152: v23.11,29.31 23.11,30 arc-90 IC1.16
  Bottom 0.152: R3.1 24.6,30.8 arc90 v23.11,29.31
GPIO2_1  (via drill 0.25)
  Top 0.152: v25.4,66.17 arc-90 25.38,66.19 IC2.16
  Bottom 0.152: R19.1 26.84,67.6 arc90 v25.4,66.17
I_SENSE0
  Top 0.152: R33.4 63.53,49.12 arc-90 66.07,51.66 IC3.2
  Top 0.254: TP34.1 arc-90 57.89,51.54 60.43,51.54 arc-90 63.53,48.44 R33.4
I_SENSE1
  Top 0.152: R34.4 62.71,69.88 62.71,70.27 arc-90 65.25,72.81 IC4.2
  Top 0.254: TP38.1 65.25,66.88 arc-90 62.71,69.42 62.71,69.88
I_SENSE1_OUT  (via drill 0.25)
  Top 0.152: IC1.29 29.31,32.02 arc90 v29.85,32.57 | v42.9,37.87 41.73,37.87 arc-90 R13.4
  Top 0.254: TP12.1 41.83,38.28 arc-90 R13.4
  Bottom 0.152: v29.85,32.57 41.36,32.57 arc90 43.05,34.27 43.05,37.72 arc90 v42.9,37.87
I_SENSE1_OUT_1  (via drill 0.25)
  Top 0.152: R29.4 42.21,74.75 arc90 v42.16,74.7 | v31.82,68.94 arc-90 31.76,68.88 IC2.29
  Top 0.254: R29.4 arc90 43.76,75.03 TP26.1
  Bottom 0.152: v42.16,74.7 39.55,74.7 arc90 38.84,73.99 38.84,72.9 arc-90 36.3,70.36 33.24,70.36 arc90 v31.82,68.94
I_SENSE2_OUT  (via drill 0.25)
  Top 0.152: IC1.12 21.72,32.02 arc-90 v21.67,32.08 | v10.77,34.59 arc-90 v10.77,34.6 R9.4
  Top 0.254: v13.87,39.12 13.87,41.86 arc90 TP14.1
  Bottom 0.152: v21.67,32.08 18.62,32.08 arc-90 18.52,32.18 arc90 18.29,32.41 12.95,32.41 arc-90 v10.77,34.59
  Bottom 0.254: v10.77,34.59 11.33,34.59 arc90 13.87,37.13 v13.87,39.12
I_SENSE2_OUT_1  (via drill 0.25)
  Top 0.152: IC2.12 23.24,68.88 arc90 v23.18,68.82 | v12.67,71.45 12.67,72.29 arc-90 R25.4
  Top 0.254: v15.9,75.92 TP28.1
  Bottom 0.152: v23.18,68.82 15.21,68.82 arc-90 12.67,71.36 v12.67,71.45
  Bottom 0.254: v12.67,71.45 13.36,71.45 arc90 15.9,73.99 v15.9,75.92
N$1
  Top 0.61: R70.1 arc90 32.7,18.06 R71.2
N$2
  Top 0.61: R71.1 31.1,15.06 arc-90 R72.2
N$3
  Top 0.61: VIN_12V.1 arc-90 34.43,16.3 R70.2
N$4
  Top 0.61: VIN_3.3V_5V.1 R65.1
N$5
  Top 0.61: VIN_1.1 57.92,86.96 arc-90 R66.1
N$6
  Top 0.61: VIN_0.1 arc-90 46.84,55.42 R67.1
N$7
  Top 0.61: VIN>5.1 70.01,13.97 arc90 R68.1
N$8
  Top 0.61: 3.3V_LOGIC.1 R69.1
N$9  (via drill 0.25)
  Top 0.152: v69.32,51.84 arc90 69.5,51.66 IC3.9
  Bottom 0.152: C11.1 arc90 69.32,52.39 v69.32,51.84
N$10  (via drill 0.25)
  Top 0.152: v68.58,50.65 arc-90 68.09,50.16 IC3.5
  Bottom 0.152: C13.1 67.95,50.02 arc90 v68.58,50.65
N$11  (via drill 0.25)
  Top 0.152: v68.38,72.01 arc-90 67.68,71.31 IC4.5
  Bottom 0.152: C14.1 arc-90 68.3,72.01 v68.38,72.01
N$12  (via drill 0.25)
  Top 0.152: v69.49,71.86 arc-90 70.45,72.81 IC4.9
  Bottom 0.152: C12.1 arc-90 69.49,71.06 v69.49,71.86
ON_0
  Top 0.152: TP36.1 68.66,54.97 | 68.66,54.97 68.66,52.93 arc-90 68.05,52.32 arc90 67.84,52.12 67.84,51.38 arc-90 67.56,51.1 66.58,51.1 arc-90 IC3.3 | JP17.2 arc-90 77.09,54.97 68.66,54.97
ON_1
  Top 0.152: TP40.1 68.4,75.44 | 68.4,75.44 68.4,73.05 arc-90 68.05,72.69 67.97,72.69 arc90 67.74,72.47 arc-90 67.59,72.31 IC4.3 | JP19.2 78.59,77.98 arc-90 76.05,75.44 68.4,75.44
ON_SIGNAL_0  (via drill 0.25)
  Top 0.152: v25.58,18.49 arc90 26.33,19.24 IC1.22
  Top 0.254: TP2.1 31.72,21.03 arc-90 29.18,18.49 v25.58,18.49
  Route15 0.152: JP13.2 arc-90 11.89,18.41 25.5,18.41 arc90 v25.58,18.49
ON_SIGNAL_1  (via drill 0.25)
  Top 0.152: IC2.22 28.56,59.04 arc-90 v28.45,58.93 32.23,58.93 arc-90 TP16.1
  Route15 0.152: JP16.2 arc-90 12.47,58.7 28.22,58.7 arc90 v28.45,58.93
OV1  (via drill 0.25)
  Top 0.152: R16.1 R16.1 arc-90 31.47,35.59 arc90 30.99,36.07 v30.2,36.07 28.78,36.07 arc90 27.89,35.18 27.89,33.65 arc90 IC1.32
  Bottom 0.152: R15.2 31.08,35.19 arc90 v30.2,36.07
OV1_1  (via drill 0.25)
  Top 0.152: IC2.32 30.25,70.99 arc-90 v32.08,72.82 32.89,72.82 arc-90 33.3,72.42 33.3,72.3 arc90 R32.1
  Bottom 0.152: v32.08,72.82 arc-90 32.91,72 R31.2
OV2  (via drill 0.25)
  Top 0.152: R8.1 21.97,33.98 arc90 v22.17,33.78 22.89,33.78 arc-90 IC1.9
  Bottom 0.152: R6.2 22.06,33.9 arc90 v22.17,33.78
OV2_1  (via drill 0.25)
  Top 0.152: IC2.9 25.38,71.09 arc90 v25.3,71.17 24.35,71.17 arc-90 R24.1
  Bottom 0.152: v25.3,71.17 arc90 24.43,72.03 R22.2
PIN_FET1
  Top 0.152: 41.22,33.47 M1.1 M1.2 41.22,32.82 | 41.22,33.47 M1.7 41.22,32.82 | 41.22,32.82 M1.5 M1.6 41.22,33.47
  Top 0.813: R13.3 41.14,33.19 arc90 M1.7
PIN_FET1_1
  Top 0.152: M3.1 42.76,70.17 arc-90 M3.7 | M3.2 42.84,69.52 arc90 M3.7 | M3.6 43.49,70.17 arc90 M3.7 | M3.5 43.41,69.52 arc-90 M3.7
  Top 0.813: M3.7 43.13,72.76 arc90 R29.3
PIN_FET2
  Top 0.152: 11.93,32.04 M2.1 M2.2 12.01,31.39 | 11.93,32.04 arc-90 M2.7 arc-90 12.01,31.39 | M2.6 11.93,32.04 | M2.5 12.01,31.39
  Top 0.813: R9.3 arc-90 12.29,36.51 M2.7
PIN_FET2_1
  Top 0.152: M4.1 14.7,69.38 arc-90 M4.7 | M4.2 14.78,68.73 arc90 M4.7 | M4.5 15.35,68.73 arc-90 M4.7 | M4.6 15.43,69.38 arc90 M4.7
  Top 0.813: M4.7 15.06,72.4 arc90 R25.3
S0  (via drill 0.25)
  Top 0.152: IC6.10 71.48,24.18 arc-90 v71.96,23.7 arc90 72.97,22.68 R63.2
  Route2 0.254: v71.45,7.82 arc90 71.96,8.33 v71.96,23.7
  Route15 0.254: JP22.1 62.41,4.85 arc-90 64.95,7.39 71.02,7.39 arc90 v71.45,7.82
  Bottom 0.152: v71.96,23.7 arc90 72.97,22.68 R48.1
S0_IN
  Top 0.152: S0.1 arc90 88.04,24.84 81.94,24.84 arc90 80.52,23.42 arc-90 79.78,22.68 R63.1
S1  (via drill 0.25)
  Top 0.152: IC6.9 arc90 70.64,22.99 v71.09,22.99 arc90 73,21.08 R64.2
  Route2 0.254: JP22.2 64.95,20.02 arc-90 v65.02,20.09
  Route15 0.254: v65.02,20.09 65.02,20.45 arc-90 67.56,22.99 v71.09,22.99
  Bottom 0.152: v71.09,22.99 arc90 73,21.08 R49.1
S1_IN
  Top 0.152: S1.1 82.45,23.75 arc90 81.61,22.91 arc-90 79.78,21.08 R64.1
S_SDA
  Top 0.152: 2_SCL.1 arc-90 52.37,31.24 58.17,31.24 arc-90 59.89,29.52 arc90 61.42,27.99 R57.1
SCL_0  (via drill 0.25)
  Top 0.152: IC6.1 69.5,27.55 arc90 v68.83,28.22 arc90 67.46,29.59 R38.2
  Top 0.254: TP4.1 81.03,41.5 arc90 v80.37,42.16 | IC1.20 25.33,25.63 arc-90 24.84,25.15 arc90 24.49,24.79 v24.49,22.89
  Route2 0.254: v69.93,42.04 arc90 68.83,40.95 v68.83,28.22 | v65.95,23.16 arc-90 66.52,22.59 v66.52,20.95
  Route15 0.254: v80.37,42.16 70.05,42.16 arc90 v69.93,42.04 | v65.95,23.16 arc-90 65.68,22.89 v24.49,22.89 | v66.52,20.95 v68.96,20.95
  Bottom 0.152: v68.83,28.22 arc90 67.46,29.59 R50.2
  Bottom 0.254: v68.96,20.95 68.96,28.09 arc90 v68.83,28.22
SCL_1  (via drill 0.25)
  Top 0.152: IC6.5 67.21,25.18 arc90 v67.01,24.97 66.45,24.97 arc90 65.89,24.41 arc-90 64.67,23.19 R41.2
  Top 0.254: TP18.1 80.75,36.35 arc-90 v78.51,38.58 | IC2.20 27.56,63.15 arc-90 v27.1,62.69
  Route2 0.254: v67.46,39.8 arc90 66.09,38.43 66.09,25.88 arc90 v67.01,24.97 65.35,24.97 arc-90 62.81,27.51 62.81,60.68 arc90 v61.49,62
  Route15 0.254: v78.51,38.58 arc90 77.77,39.32 67.95,39.32 arc-90 v67.46,39.8 | v27.1,62.69 arc-90 27.31,62.89 43.79,62.89 arc-90 44.15,62.53 arc90 44.42,62.26 61.24,62.26 arc-90 v61.49,62
  Bottom 0.152: v67.01,24.97 66.47,24.97 arc90 65.89,24.38 arc-90 64.69,23.19 R52.1
SCL_2  (via drill 0.25)
  Top 0.152: IC6.2 68.45,26.88 arc90 v68.05,27.28 arc90 67.34,27.99 R57.2
  Top 0.254: TP42.1 61.32,38.23 arc-90 v61.93,37.62 | IC3.6 arc90 68.91,48.23 v68.91,48.16
  Route2 0.254: v61.93,37.62 arc90 61.01,36.7 v61.01,27.25 | v68.91,48.16 68.91,42.67 arc-90 68.66,42.42 arc90 68.2,41.96 68.2,36.17 arc-90 67.79,35.76 arc90 67.18,35.15 67.18,28.14 arc90 v68.05,27.28
  Route15 0.254: v61.01,27.25 68.02,27.25 arc90 v68.05,27.28
  Bottom 0.152: v68.05,27.28 arc90 67.34,27.99 R55.1
SCL_3  (via drill 0.25)
  Top 0.152: IC6.4 65.1,25.68 arc-90 v64.95,25.83 65.2,25.83 65.74,25.3 arc-90 65.23,24.79 R60.2
  Top 0.254: TP44.1 61.29,33.86 arc-90 v61.77,33.38 | IC4.6 70.5,71.31 arc90 v68.78,69.6
  Route2 0.254: v60.99,25.55 arc90 61.77,26.34 v61.77,33.38 | v68.78,69.6 68.78,69.47 arc-90 68.2,68.89 66.75,68.89 arc90 64.21,66.34 64.21,26.57 arc90 v64.95,25.83
  Route15 0.254: v64.95,25.83 61.26,25.83 arc90 v60.99,25.55
  Bottom 0.152: v64.95,25.83 65.23,25.83 65.74,25.32 arc-90 65.2,24.79 R53.1
SCL_IN  (via drill 0.25)
  Top 0.152: IC6.3 67.93,26.18 arc-90 v67.49,26.62 63.89,26.62 arc90 R56.2
  Route2 0.254: JP22.4 70.03,24.08 arc90 v67.49,26.62
  Bottom 0.152: v67.49,26.62 63.87,26.62 arc90 R54.1
SCL_INPUT
  Top 0.152: SCL_IN.1 56.44,30.05 arc-90 58.98,27.51 58.98,27.41 arc90 59.99,26.39 R56.1
SDA_0  (via drill 0.25)
  Top 0.152: IC6.12 v72.51,25.18 arc-90 v72.52,25.17 arc-90 73.23,25.88 R39.2
  Top 0.254: TP5.1 arc90 65.25,38.15 v67.54,38.15 | IC1.19 24.83,26.51 arc-90 v24.26,25.93
  Route2 0.254: v70.71,37.64 arc90 70.38,37.31 70.38,26.34 arc90 71.55,25.17 v72.52,25.17
  Route15 0.254: v67.54,38.15 70.21,38.15 arc-90 v70.71,37.64 | v24.26,25.93 arc-90 24.56,26.24 60.48,26.24 arc90 60.6,26.36 arc-90 60.81,26.57 65.99,26.57 arc-90 66.32,26.24 arc90 66.7,25.86 69.72,25.86 arc-90 69.9,25.68 arc90 70.41,25.17 v72.52,25.17
  Bottom 0.152: v72.52,25.17 arc-90 73.23,25.88 R46.1
SDA_1  (via drill 0.25)
  Top 0.152: IC6.14 IC6.14 arc90 v72.09,27.2 arc-90 73.96,29.08 R42.2
  Top 0.254: TP19.1 67.84,33.83 arc90 v67.89,33.88 | IC2.19 27.06,64.67 arc-90 v26.44,64.05
  Route2 0.254: v72.29,33.73 72.29,27.41 | 72.29,27.41 arc-90 v72.09,27.2 | v72.26,62.18 72.26,41.86 arc90 72.62,41.5 arc-90 73.03,41.1 73.03,28.14 arc-90 72.29,27.41
  Route15 0.254: v67.89,33.88 72.14,33.88 arc-90 v72.29,33.73 | v26.44,64.05 26.44,64.04 arc90 27,63.48 44.35,63.48 arc-90 44.42,63.4 arc90 44.7,63.12 71.32,63.12 arc-90 v72.26,62.18
  Bottom 0.152: v72.09,27.2 arc-90 73.96,29.08 R44.1
SDA_2  (via drill 0.25)
  Top 0.152: IC6.15 71.05,27.39 arc-90 v71.09,27.43 71.09,28.14 arc-90 73.63,30.68 R58.2
  Top 0.254: TP41.1 arc90 73.33,41.1 v71.48,41.1 | IC3.7 71.59,50.66 arc-90 72.16,50.09 72.16,49.35 arc-90 v71.6,48.79
  Route2 0.254: v71.48,41.1 arc-90 72.09,40.49 72.09,35.41 arc-90 71.6,34.92 arc90 71.09,34.42 | 71.09,34.42 71.09,34.11 v71.09,27.43 | v71.6,48.79 arc90 71.22,48.41 71.22,41.99 arc-90 71.07,41.83 arc90 70.92,41.68 70.92,40.44 arc90 71.27,40.08 arc-90 71.55,39.8 71.55,35.69 arc-90 71.37,35.51 arc90 71.09,35.23 71.09,34.42
  Bottom 0.152: v71.09,27.43 71.09,28.14 arc-90 73.63,30.68 R43.1
SDA_3  (via drill 0.25)
  Top 0.152: IC6.11 72.12,24.68 arc-90 v72.44,24.36 arc90 72.52,24.28 R61.2
  Top 0.254: TP43.1 74.42,34.52 arc-90 v74.4,34.49 | IC4.7 72.99,71.81 arc-90 v73.51,71.3
  Route2 0.254: v74.4,23.52 v74.4,34.49 arc-90 73.51,35.38 v73.51,71.3
  Route15 0.254: v74.4,23.52 73.28,23.52 arc-90 v72.44,24.36
  Bottom 0.152: v72.44,24.36 75.37,24.36 arc-90 R47.1
SDA_IN  (via drill 0.25)
  Top 0.152: IC6.13 71.73,25.68 arc90 v72.38,26.33 72.51,26.33 arc90 73.08,26.9 arc-90 73.66,27.48 R59.2
  Route2 0.254: v73.71,6.86 73.71,25 arc90 v72.38,26.33
  Route15 0.254: JP22.3 67.49,5.82 arc-90 68.25,6.58 73.43,6.58 arc90 v73.71,6.86
  Bottom 0.152: v72.38,26.33 72.51,26.33 arc90 73.08,26.9 arc-90 73.66,27.48 R45.1
SDA_INPUT
  Top 0.152: SDA_IN.1 82.48,30.61 arc90 80.72,28.85 arc-90 79.35,27.48 R59.1
SETUP
  Top 0.203: IC1.3 IC1.2 26.83,36.61 arc90 C2.1
SETUP_1
  Top 0.152: C7.1 arc-90 29.11,73.39 29.11,71.11 arc-90 IC2.2 IC2.3
SS
  Top 0.152: IC1.1 27.33,36.6 arc-90 27.58,36.85 arc90 27.74,37.01 C4.1
SS_1
  Top 0.254: IC2.1 29.56,71.93 arc-90 30.02,72.39 arc90 30.15,72.52 C9.1
TIMER
  Top 0.152: IC1.8 arc-90 23.55,34.49 C3.1
TIMER_1
  Top 0.152: C8.1 arc90 25.53,74.17 25.53,72.16 arc90 25.83,71.86 arc-90 26.06,71.62 IC2.8
UV1  (via drill 0.25)
  Top 0.152: R14.2 28.88,35 arc90 v28.5,34.62 arc-90 28.96,34.16 28.96,33.76 arc-90 28.22,33.02 IC1.31
  Bottom 0.152: R15.1 v28.5,34.62 28.5,36.73 C5.1
UV1_1  (via drill 0.25)
  Top 0.152: R30.2 32.08,71.4 arc-90 v31.27,70.59 arc-90 30.56,69.88 IC2.31
  Bottom 0.152: v31.27,70.59 31.27,71.89 arc-90 R31.1 arc-90 30.44,72.8 C10.1
UV2  (via drill 0.25)
  Top 0.152: IC1.10 21.23,33.02 arc-90 v20.32,33.93 20.32,35.09 arc-90 R7.2
  Bottom 0.152: v20.32,33.93 20.32,35.91 arc90 R6.1 arc-90 19.39,36.83 C1.1
UV2_1  (via drill 0.25)
  Top 0.152: R23.2 R23.2 arc90 v22.99,70.92 arc90 24.02,69.88 IC2.10
  Bottom 0.152: v22.99,70.92 arc-90 21.99,71.92 R22.1 arc-90 21.3,72.72 C6.1
V_SENSE0
  Top 0.152: R33.2 60.99,54.7 arc90 63.53,52.16 IC3.1
  Top 0.254: TP33.1 60.73,54.97 arc-90 R33.2
V_SENSE1
  Top 0.152: IC4.1 62.71,73.31 arc-90 60.17,75.85 R34.2 56.16,76.56 arc-90 TP37.1
VIN>5V
  Top 0.61: IC5.3 64.82,14.02 arc-90 VIN>5.2
  Top 0.813: JP4.5 arc-90 59.51,4.12 C15.1 59.51,13.7 arc-90 IC5.3
VIN_0  (via drill 0.8)
  Top 0.61: v58.22,57.12 54.58,57.12 arc90 53.77,56.31 arc-90 51.41,53.95 VIN_0.2
  Top 0.813: v58.22,57.12 60.35,57.12 arc-90 62.89,54.59 R33.1
  Route2 0.813: JP4.4 57.33,56.24 arc-90 v58.22,57.12
VIN_1  (via drill 0.8)
  Top 0.61: v55.4,79.93 arc-90 55.12,80.22 VIN_1.2
  Top 0.813: v55.4,79.93 59.54,79.93 arc-90 62.08,77.39 R34.1
  Route2 0.813: JP4.3 54.79,79.32 arc-90 v55.4,79.93
VIN_3.3V_5V  (via drill 0.35, 0.8)
  Top 0.61: v3,38.28 VIN_3.3V_5V.2
  Top 0.813: v15.06,36.3 arc-90 15.09,36.32 R9.1 19.95,36.32 arc90 R7.1 | v17.04,71.98 arc-90 18.06,73 R25.1 21.83,73 arc90 R23.1
  Route2 0.813: v15.88,8.69 arc-90 15.06,9.5 v15.06,36.3 arc90 16.99,38.23 16.99,71.93 arc-90 v17.04,71.98
  Route15 0.61: v15.06,36.3 6.71,36.3 arc-90 6.02,36.98 arc90 4.72,38.28 v3,38.28
  Route15 0.813: JP4.2 52.25,6.15 arc90 49.71,8.69 v15.88,8.69
VIN_12V  (via drill 0.8)
  Top 0.61: VIN_12V.2 arc90 35.05,11.86 v35.05,7.11
  Top 0.813: R14.1 arc-90 31.19,38.94 33.62,38.94 arc-90 R13.1 35.17,39.92 arc90 v35.15,39.93 | R30.1 32.08,75.18 arc-90 32.89,76 35.19,76 arc-90 R29.1 37.07,77.31 arc90 v37.06,77.32
  Route2 0.813: v35.15,39.93 35.15,7.21 v35.05,7.11 | v37.06,77.32 arc-90 37.29,77.09 37.29,65.43 arc90 37.82,64.9 arc-90 39.78,62.94 v39.78,40.26
  Route15 0.813: v35.05,7.11 47.17,7.11 arc-90 49.71,4.57 JP4.1 | v35.15,39.93 39.45,39.93 arc90 v39.78,40.26
VOUT_1  (via drill 0.25)
  Top 0.152: IC1.27 29.15,31.02 arc90 v29.16,31.04 30.67,31.04 arc-90 R11.1 39.08,29.9 arc90 M1.8 41.22,32.17 M1.4
  Top 0.254: TP45.1 31.7,29.78 arc-90 R11.1 | v42.24,31.24 42.02,31.24 arc-90 M1.8
  Route2 0.254: JP1.4 42.19,3.89 42.19,31.19 arc-90 v42.24,31.24
  Bottom 0.152: R10.2 arc-90 27.28,31.66 27.28,31.62 arc90 27.86,31.04 v29.16,31.04
VOUT_1_1  (via drill 0.25)
  Top 0.152: IC2.27 31.45,67.88 arc-90 v31.98,67.35 | M3.4 arc-90 43.94,68.75 M3.8
  Top 0.254: TP47.1 34.42,64.11 arc90 v35.51,65.2 40.59,65.2 arc90 43.13,67.74 M3.8
  Route2 0.254: JP1.2 37.01,63.7 arc90 v35.51,65.2
  Bottom 0.152: R27.1 arc90 33.22,67.35 v31.98,67.35 arc90 31.61,67.72 30.53,67.72 arc-90 30.25,68 arc90 30.02,68.22 29.77,68.22 arc-90 28.85,69.14 R26.2
  Bottom 0.254: R27.1 arc90 35.37,65.2 v35.51,65.2
VOUT_2  (via drill 0.25)
  Top 0.152: IC1.14 22.3,31.02 arc90 R1.1 20.16,30.04 arc90 v19.96,30.23 | M2.8 arc-90 12.42,30.74 M2.4
  Top 0.254: v22.02,27.08 19.79,27.08 arc90 TP46.1 arc90 20.16,27.45 R1.1 15.09,28.88 arc-90 M2.4
  Route2 0.254: v20.32,5.69 20.42,5.79 20.42,25.48 arc-90 v22.02,27.08
  Route15 0.254: JP1.3 arc90 37.64,5.69 v20.32,5.69
  Bottom 0.152: R3.2 arc-90 24.02,31.5 22.12,31.5 arc90 21.49,30.86 arc-90 20.85,30.23 v19.96,30.23
VOUT_2_1  (via drill 0.25)
  Top 0.152: IC2.14 24.55,67.88 arc90 v24.46,67.79 arc90 23.39,66.73 arc-90 22.61,65.94 R17.1 | M4.8 arc-90 15.19,68.08 M4.4
  Top 0.254: TP48.1 22.63,65.91 arc90 22.61,65.94 | v18.21,63.3 18.21,63.4 arc-90 20.75,65.94 | 20.75,65.94 R17.1 | M4.4 arc90 18.14,65.94 20.75,65.94
  Route2 0.254: v33.3,6.3 arc-90 34.47,5.13 JP1.1 | v18.21,63.3 18.21,43.87 arc90 18.77,43.31 arc-90 19.2,42.88 19.2,18.21 arc-90 18.59,17.6 arc90 18.21,17.22 v18.21,6.33
  Route15 0.254: v18.21,6.33 33.27,6.33 arc-90 v33.3,6.3
  Bottom 0.152: R19.2 26.87,68.83 arc-90 26.39,68.35 arc90 26.09,68.05 26.09,68 arc-90 25.88,67.79 v24.46,67.79
VOUT_3  (via drill 0.25)
  Top 0.152: M5.8 62.46,44.08 arc90 M5.4
  Top 0.254: v61.04,43.03 arc90 61.65,43.64 M5.8
  Route2 0.254: JP1.6 47.17,41.66 arc-90 v47.98,42.47
  Route15 0.254: v47.98,42.47 60.48,42.47 arc90 v61.04,43.03
VOUT_4  (via drill 0.25)
  Top 0.254: M6.4 arc-90 61.54,65.57 M6.8 arc-90 59.75,64.59 v59.72,64.59
  Route2 0.254: v45.34,63.88 45.34,4.5 arc-90 JP1.5
  Route15 0.254: v59.72,64.59 46.05,64.59 arc90 v45.34,63.88
VOUT_FET_0
  Top 0.152: M5.7 arc-90 62.01,45.51 M5.6 | M5.5 61.93,44.86 | 61.93,44.86 arc-90 M5.7 | M5.2 61.93,44.86 | M5.1 61.28,45.51 arc-90 M5.7
  Top 0.813: R33.3 arc-90 61.65,48.27 M5.7
VOUT_FET_1
  Top 0.152: M6.7 arc-90 61.1,67 M6.6 | M6.7 arc90 61.02,66.34 M6.5 | M6.7 arc-90 60.45,66.34 M6.2 | M6.7 arc90 60.37,67 M6.1 | R34.3 60.81,66.71 arc-90 M6.7
VSENSE_1  (via drill 0.25)
  Top 0.152: 34.72,35.46 R13.2 33.53,35.48 arc90 v33.48,35.43 | IC1.30 28.58,32.52 arc90 v29.53,33.48
  Top 0.254: TP11.1 37.77,38 arc-90 35.23,35.46 34.72,35.46
  Bottom 0.152: v29.53,33.48 31.52,33.48 arc90 v33.48,35.43
VSENSE_1_1  (via drill 0.25)
  Top 0.152: IC2.30 31.12,69.38 arc90 v31.28,69.54 | v36.25,70.94 36.25,71.83 arc-90 R29.2
  Top 0.254: v36.25,70.94 36.93,70.94 arc90 39.73,73.74 TP25.1
  Bottom 0.152: v31.28,69.54 31.31,69.54 arc90 31.72,69.95 arc-90 32.59,70.81 36.12,70.81 arc90 v36.25,70.94
VSENSE_2  (via drill 0.25)
  Top 0.152: R9.2 17.63,38.74 arc-90 v17.98,39.09 | v20.54,32.64 23.03,32.64 arc-90 IC1.11
  Top 0.254: TP13.1 17.91,39.17 arc90 v17.98,39.09
  Bottom 0.152: v17.98,39.09 17.98,35.18 arc90 20.52,32.64 v20.54,32.64
VSENSE_2_1  (via drill 0.25)
  Top 0.152: IC2.11 23.37,69.38 arc-90 v22.66,70.09 | v20.52,75.92 arc90 19.61,75.01 R25.2
  Top 0.254: TP27.1 arc90 19.61,78.33 R25.2
  Bottom 0.152: v22.66,70.09 arc-90 20.52,72.23 v20.52,75.92

## Text on the board
tNames: ADCIN_2_0 | !ALERT_0 | !ALERT_1 | ADCIN_2_1 | ADCIN_1_1 | VOUT_2_1 | VOUT_1_1 | VOUT_2 | VOUT_1 | ADCIN_1_0 | VOUT_4 | VOUT_3 | VIN_12V | VIN_3.3V_5V | VIN_1 | VIN_0 | VIN>5V | S0 | S1 | SDA_IN | SCL_IN | !ENABLE_MUX